# Altium schematic sheet MercurialSDR_PWR.SchDoc: MercurialSDR - Power Stage
size A4; Author: Andres Hojnadel; DrawnBy: Andres Hojnadel; Revision: Rev2.0; SheetNumber: 2; SheetTotal: 6
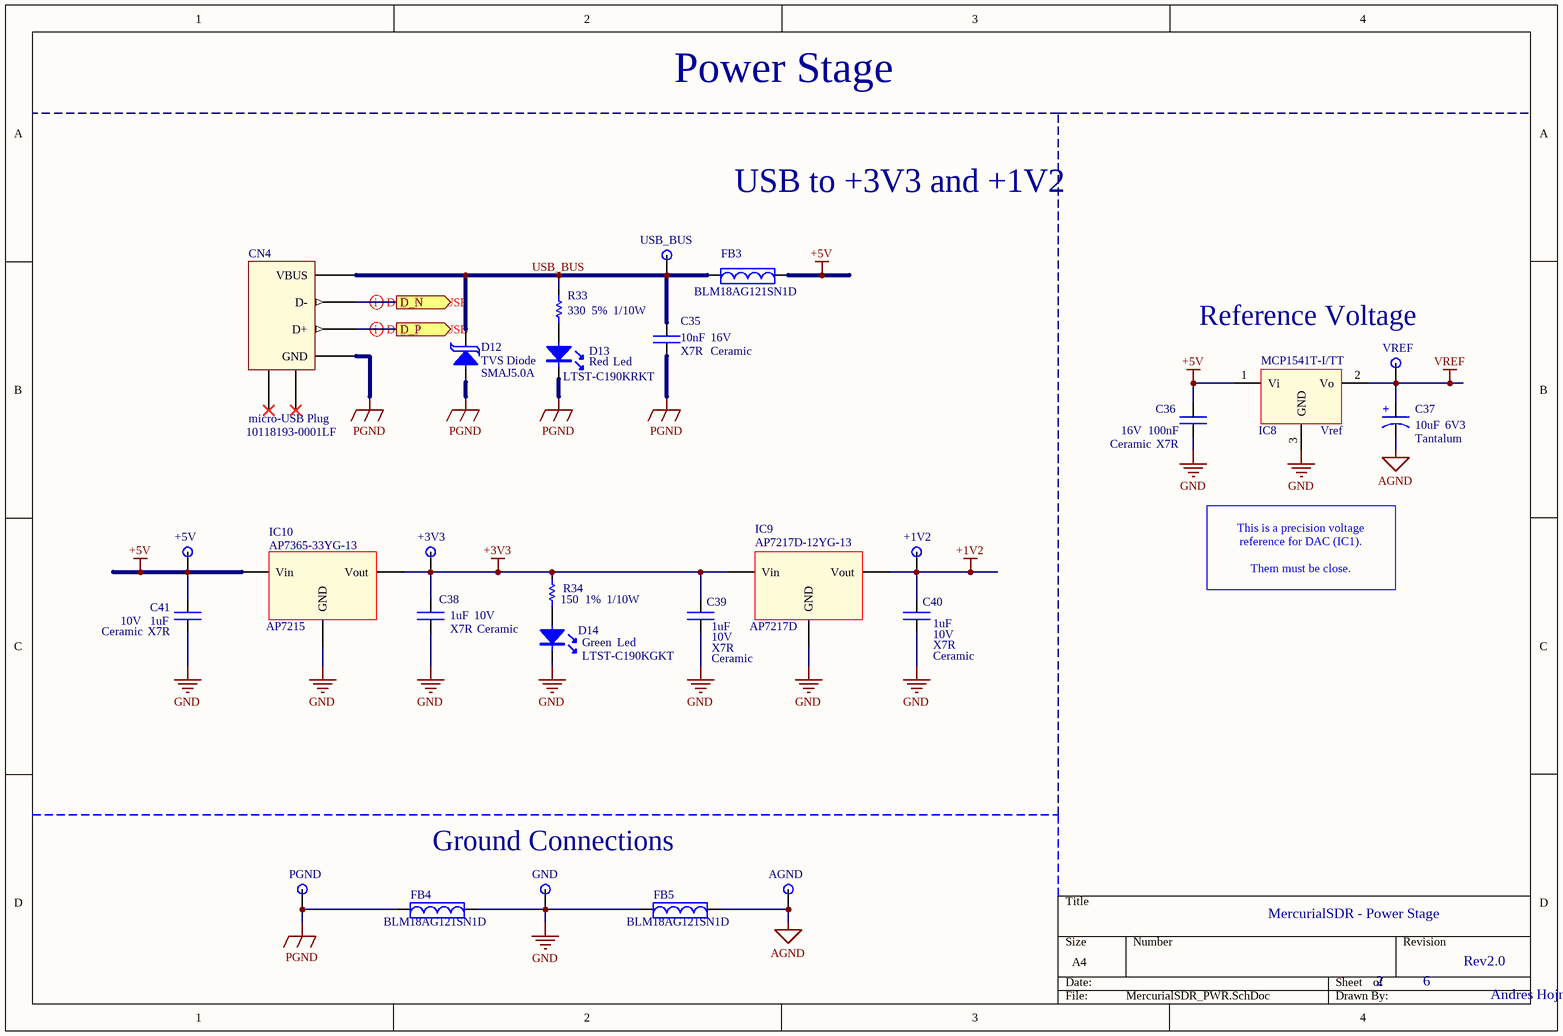
[diagram p0: MercurialSDR_PWR.SchDoc]

## Parts
C35  value 10nF  Temp Coef: X7R  VR: 16V  Material: Ceramic  [CAP_0603]  (hidden comment: Capacitor)
C36  value 100nF  Temp Coef: X7R  VR: 16V  Material: Ceramic  [CAP_0603]  (hidden comment: Capacitor)
C37  value 10uF  VR: 6V3  Material: Tantalum  [CAP_TANT_1206]  (hidden comment: Capacitor Polarizado)
C38  value 1uF  Temp Coef: X7R  VR: 10V  Material: Ceramic  [CAP_0603]  (hidden comment: Capacitor)
C39  value 1uF  Temp Coef: X7R  VR: 10V  Material: Ceramic  [CAP_0603]  (hidden comment: Capacitor)
C40  value 1uF  Temp Coef: X7R  VR: 10V  Material: Ceramic  [CAP_0603]  (hidden comment: Capacitor)
C41  value 1uF  Temp Coef: X7R  VR: 10V  Material: Ceramic  [CAP_0603]  (hidden comment: Capacitor)
CN4  micro-USB Plug  Part Number: 10118193-0001LF  [USB_Micro]
D12  TVS Diode  Part Number: SMAJ5.0A  [DO-214AC]
D13  Led  Color: Red  Part Number: LTST-C190KRKT  [LED_0603]
D14  Led  Color: Green  Part Number: LTST-C190KGKT  [LED_0603]
FB3  Part Number: BLM18AG121SN1D  [FERRITE_BEAD_0603]  (hidden comment: Ferrite Bead)
FB4  Part Number: BLM18AG121SN1D  [FERRITE_BEAD_0603]  (hidden comment: Ferrite Bead)
FB5  Part Number: BLM18AG121SN1D  [FERRITE_BEAD_0603]  (hidden comment: Ferrite Bead)
IC8  Vref  Part Number: MCP1541T-I/TT  [SOT-23-3]
IC9  AP7217D  Part Number: AP7217D-12YG-13  [SOT89-3L]
IC10  AP7215  Part Number: AP7365-33YG-13  [SOT89-3L]
R33  value 330  Power: 1/10W  Tolerance: 5%  [RES_0603]  (hidden comment: Resistor SMD)
R34  value 150  Power: 1/10W  Tolerance: 1%  [RES_0603]  (hidden comment: Resistor SMD)
TP9  TP Name: USB_BUS  [TP_TOP]  (hidden comment: Test Point)
TP10  TP Name: VREF  [TP_TOP]  (hidden comment: Test Point)
TP11  TP Name: +5V  [TP_TOP]  (hidden comment: Test Point)
TP12  TP Name: +3V3  [TP_TOP]  (hidden comment: Test Point)
TP13  TP Name: +1V2  [TP_TOP]  (hidden comment: Test Point)
TP14  TP Name: PGND  [TP_TH]  (hidden comment: Test Point)
TP15  TP Name: GND  [TP_TOP]  (hidden comment: Test Point)
TP16  TP Name: AGND  [TP_TOP]  (hidden comment: Test Point)

## Ports
D_N (out), D_P (out)

## Nets
+1V2: C40.1 IC9.3(Vout) TP13.1(TP?)
+3V3: C38.1 C39.1 IC9.2(Vin) IC10.1(Vout) R34.1 TP12.1(TP?)
+5V: C36.1 C41.1 FB3.2 IC8.1(Vi) IC10.3(Vin) TP11.1(TP?)
AGND: C37.2 FB5.2 TP16.1(TP?)
GND: C36.2 C38.2 C39.2 C40.2 C41.2 D14.2(K) FB4.2 FB5.1 IC8.3(GND) IC9.1(GND) IC10.2(GND) TP15.1(TP?)
PGND: C35.2 CN4.4(GND) D12.1(A) D13.2(K) FB4.1 TP14.1(TP?)
VREF: C37.1 IC8.2(Vo) TP10.1(TP?)
D_N: CN4.2(D-) ; port D_N
D_P: CN4.3(D+) ; port D_P
USB_BUS: C35.1 CN4.1(VBUS) D12.2(K) FB3.1 R33.1 TP9.1(TP?)
NetD13_1: D13.1(A) R33.2
NetD14_1: D14.1(A) R34.2

Not connected (* = marked no-connect by the designer): CN4 5(Shield)* 6(Shield)*

## Layout directives
differential pair: D_N, D_P

## Notes on the sheet
- Power Stage
- USB to +3V3 and +1V2
- (near TP10) Reference Voltage
- This is a precision voltage
  reference for DAC (IC1).
  Them must be close.
- (near TP15) Ground Connections
- (in symbol Cap Pol) +

## Library data of the parts
C35 = Cap: Capacitor no polarizado; Part Number: CC0603KRX7R7BB103
C36 = Cap: Capacitor no polarizado; Part Number: CL10B104KO8NNNC
C37 = Cap Pol: Part Number: TAJA106K006RNJ; Temp Coef: *
C38-C41 = Cap: Capacitor no polarizado; Part Number: CL10B105KP8NNNC
CN4 = USB Plug
D12 = TVS_DIODE: TVS (Supresor de transitorios); Vr: 5V; Vrb: 6.4V; Vc: 9.2V
FB3 = Ferrite Bead: In: 800mA
IC8 = MCP1541: Reference Voltage; Reference Voltage: 4.096V
IC9 = AP7217D: Linear Voltage Regulator 1V2
IC10 = AP7215: Linear Voltage Regulator 3v3
R33 = Res: Resistor; Part Number: CR0603-JW-331ELF
R34 = Res: Resistor; Part Number: ERJ-3EKF1500V
FB4 FB5 = Ferrite Bead: In: *